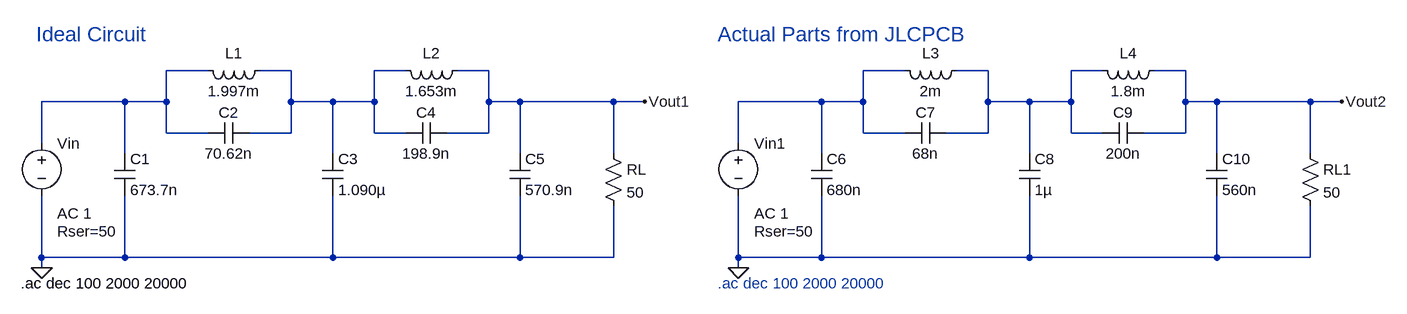
[diagram p0: schematic LPFilter_5kHz_Elliptical.asc]
LPFilter_5kHz_Elliptical.asc, the LTspice schematic file:
Version 4.1
SHEET 1 2100 728
WIRE 272 -128 208 -128
WIRE 400 -128 352 -128
WIRE 576 -128 528 -128
WIRE 704 -128 656 -128
WIRE 1344 -128 1280 -128
WIRE 1472 -128 1424 -128
WIRE 1648 -128 1600 -128
WIRE 1776 -128 1728 -128
WIRE 144 -80 16 -80
WIRE 208 -80 208 -128
WIRE 208 -80 144 -80
WIRE 400 -80 400 -128
WIRE 464 -80 400 -80
WIRE 528 -80 528 -128
WIRE 528 -80 464 -80
WIRE 704 -80 704 -128
WIRE 752 -80 704 -80
WIRE 896 -80 752 -80
WIRE 944 -80 896 -80
WIRE 1216 -80 1088 -80
WIRE 1280 -80 1280 -128
WIRE 1280 -80 1216 -80
WIRE 1472 -80 1472 -128
WIRE 1536 -80 1472 -80
WIRE 1600 -80 1600 -128
WIRE 1600 -80 1536 -80
WIRE 1776 -80 1776 -128
WIRE 1824 -80 1776 -80
WIRE 1968 -80 1824 -80
WIRE 2016 -80 1968 -80
WIRE 208 -32 208 -80
WIRE 272 -32 208 -32
WIRE 400 -32 400 -80
WIRE 400 -32 336 -32
WIRE 528 -32 528 -80
WIRE 576 -32 528 -32
WIRE 704 -32 704 -80
WIRE 704 -32 640 -32
WIRE 1280 -32 1280 -80
WIRE 1344 -32 1280 -32
WIRE 1472 -32 1472 -80
WIRE 1472 -32 1408 -32
WIRE 1600 -32 1600 -80
WIRE 1648 -32 1600 -32
WIRE 1776 -32 1776 -80
WIRE 1776 -32 1712 -32
WIRE 16 -16 16 -80
WIRE 1088 -16 1088 -80
WIRE 144 0 144 -80
WIRE 464 0 464 -80
WIRE 752 0 752 -80
WIRE 896 0 896 -80
WIRE 1216 0 1216 -80
WIRE 1536 0 1536 -80
WIRE 1824 0 1824 -80
WIRE 1968 0 1968 -80
WIRE 16 160 16 64
WIRE 144 160 144 64
WIRE 144 160 16 160
WIRE 464 160 464 64
WIRE 464 160 144 160
WIRE 752 160 752 64
WIRE 752 160 464 160
WIRE 896 160 896 80
WIRE 896 160 752 160
WIRE 1088 160 1088 64
WIRE 1216 160 1216 64
WIRE 1216 160 1088 160
WIRE 1536 160 1536 64
WIRE 1536 160 1216 160
WIRE 1824 160 1824 64
WIRE 1824 160 1536 160
WIRE 1968 160 1968 80
WIRE 1968 160 1824 160
WIRE 16 176 16 160
WIRE 1088 176 1088 160
FLAG 16 176 0
FLAG 1088 176 0
FLAG 944 -80 Vout1
FLAG 2016 -80 Vout2
SYMBOL voltage 16 -32 R0
WINDOW 123 24 124 Left 2
WINDOW 39 24 152 Left 2
SYMATTR Value2 AC 1
SYMATTR SpiceLine Rser=50
SYMATTR InstName Vin
SYMATTR Value ""
SYMBOL cap 128 0 R0
SYMATTR InstName C1
SYMATTR Value 673.7n
SYMBOL cap 336 -48 R90
WINDOW 0 0 32 VBottom 2
WINDOW 3 32 32 VTop 2
SYMATTR InstName C2
SYMATTR Value 70.62n
SYMBOL ind 368 -144 R90
WINDOW 0 5 56 VBottom 2
WINDOW 3 32 56 VTop 2
SYMATTR InstName L1
SYMATTR Value 1.997m
SYMBOL cap 448 0 R0
SYMATTR InstName C3
SYMATTR Value 1.090µ
SYMBOL cap 640 -48 R90
WINDOW 0 0 32 VBottom 2
WINDOW 3 32 32 VTop 2
SYMATTR InstName C4
SYMATTR Value 198.9n
SYMBOL ind 672 -144 R90
WINDOW 0 5 56 VBottom 2
WINDOW 3 32 56 VTop 2
SYMATTR InstName L2
SYMATTR Value 1.653m
SYMBOL cap 736 0 R0
SYMATTR InstName C5
SYMATTR Value 570.9n
SYMBOL res 880 -16 R0
SYMATTR InstName RL
SYMATTR Value 50
SYMBOL voltage 1088 -32 R0
WINDOW 123 24 124 Left 2
WINDOW 39 24 152 Left 2
SYMATTR Value2 AC 1
SYMATTR SpiceLine Rser=50
SYMATTR InstName Vin1
SYMATTR Value ""
SYMBOL cap 1200 0 R0
SYMATTR InstName C6
SYMATTR Value 680n
SYMBOL cap 1408 -48 R90
WINDOW 0 0 32 VBottom 2
WINDOW 3 32 32 VTop 2
SYMATTR InstName C7
SYMATTR Value 68n
SYMBOL ind 1440 -144 R90
WINDOW 0 5 56 VBottom 2
WINDOW 3 32 56 VTop 2
SYMATTR InstName L3
SYMATTR Value 2m
SYMATTR SpiceLine Rser=12.35
SYMBOL cap 1520 0 R0
SYMATTR InstName C8
SYMATTR Value 1µ
SYMBOL cap 1712 -48 R90
WINDOW 0 0 32 VBottom 2
WINDOW 3 32 32 VTop 2
SYMATTR InstName C9
SYMATTR Value 200n
SYMBOL ind 1744 -144 R90
WINDOW 0 5 56 VBottom 2
WINDOW 3 32 56 VTop 2
SYMATTR InstName L4
SYMATTR Value 1.8m
SYMATTR SpiceLine Rser=11.7
SYMBOL cap 1808 0 R0
SYMATTR InstName C10
SYMATTR Value 560n
SYMBOL res 1952 -16 R0
SYMATTR InstName RL1
SYMATTR Value 50
TEXT -16 200 Left 2 !.ac dec 100 2000 20000
TEXT 1056 200 Left 2 ;.ac dec 100 2000 20000
TEXT 8 -184 Left 3 ;Ideal Circuit
TEXT 1056 -184 Left 3 ;Actual Parts from JLCPCB

The netlist it stands for:
* LPFilter_5kHz_Elliptical.asc
Vin N001 0 AC 1 Rser=50
C1 N001 0 673.7n
C2 N002 N001 70.62n
L1 N002 N001 1.997m
C3 N002 0 1.090µ
C4 Vout1 N002 198.9n
L2 Vout1 N002 1.653m
C5 Vout1 0 570.9n
RL Vout1 0 50
Vin1 N003 0 AC 1 Rser=50
C6 N003 0 680n
C7 N004 N003 68n
L3 N004 N003 2m Rser=12.35
C8 N004 0 1µ
C9 Vout2 N004 200n
L4 Vout2 N004 1.8m Rser=11.7
C10 Vout2 0 560n
RL1 Vout2 0 50
.ac dec 100 2000 20000
* .ac dec 100 2000 20000
* Ideal Circuit
* Actual Parts from JLCPCB
.backanno
.end

* Results of the author's LTspice run, read from the files saved beside the schematic
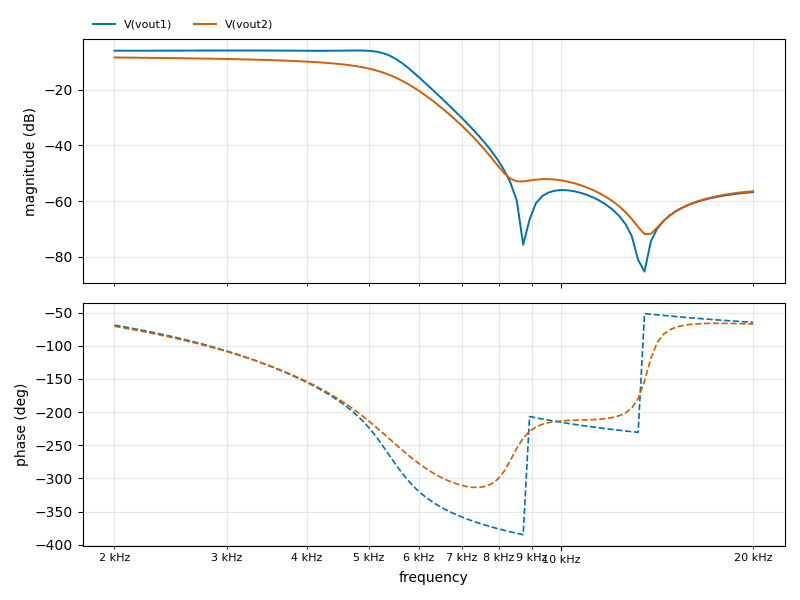
[diagram p1: AC Analysis of LPFilter_5kHz_Elliptical.asc, plotted from the saved traces]
* AC Analysis, 1 run:
*   V(vout1): -6.11 dB at 2 kHz, -56.77 dB at 20 kHz, peak -6.02 dB at 3.17 kHz, 3 dB below the peak at 5.514 kHz
*   V(vout2): -8.52 dB at 2 kHz, -56.43 dB at 20 kHz, peak -8.52 dB at 2 kHz, 3 dB below the peak at 4.745 kHz